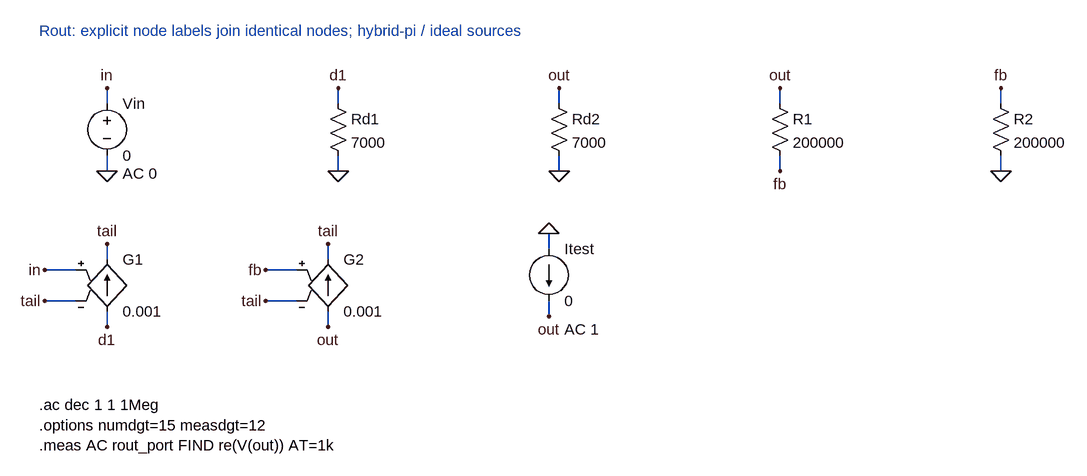
[diagram p0: schematic Rout.asc]
Rout.asc, the LTspice schematic file:
Version 4
SHEET 1 1800 1500
TEXT 16 -48 Left 2 ;Rout: explicit node labels join identical nodes; hybrid-pi / ideal sources
WIRE 120 64 120 40
FLAG 120 40 in
WIRE 120 144 120 168
FLAG 120 168 0
SYMBOL voltage 120 48 R0
SYMATTR InstName Vin
WINDOW 123 24 124 Left 2
SYMATTR Value 0
SYMATTR Value2 AC 0
WIRE 476 64 476 40
FLAG 476 40 d1
WIRE 476 144 476 168
FLAG 476 168 0
SYMBOL res 460 48 R0
SYMATTR InstName Rd1
SYMATTR Value 7000
WIRE 816 64 816 40
FLAG 816 40 out
WIRE 816 144 816 168
FLAG 816 168 0
SYMBOL res 800 48 R0
SYMATTR InstName Rd2
SYMATTR Value 7000
WIRE 1156 64 1156 40
FLAG 1156 40 out
WIRE 1156 144 1156 168
FLAG 1156 168 fb
SYMBOL res 1140 48 R0
SYMATTR InstName R1
SYMATTR Value 200000
WIRE 1496 64 1496 40
FLAG 1496 40 fb
WIRE 1496 144 1496 168
FLAG 1496 168 0
SYMBOL res 1480 48 R0
SYMATTR InstName R2
SYMATTR Value 200000
WIRE 120 384 120 408
FLAG 120 408 d1
WIRE 120 304 120 280
FLAG 120 280 tail
WIRE 72 320 24 320
FLAG 24 320 in
WIRE 72 368 24 368
FLAG 24 368 tail
SYMBOL g 120 288 R0
SYMATTR InstName G1
SYMATTR Value 0.001
WIRE 460 384 460 408
FLAG 460 408 out
WIRE 460 304 460 280
FLAG 460 280 tail
WIRE 412 320 364 320
FLAG 364 320 fb
WIRE 412 368 364 368
FLAG 364 368 tail
SYMBOL g 460 288 R0
SYMATTR InstName G2
SYMATTR Value 0.001
WIRE 800 288 800 264
FLAG 800 264 0
WIRE 800 368 800 392
FLAG 800 392 out
SYMBOL current 800 288 R0
SYMATTR InstName Itest
WINDOW 123 24 124 Left 2
SYMATTR Value 0
SYMATTR Value2 AC 1
TEXT 16 528 Left 2 !.ac dec 1 1 1Meg\n.options numdgt=15 measdgt=12\n.meas AC rout_port FIND re(V(out)) AT=1k

The netlist it stands for:
* Rout.asc
Vin in 0 0 AC 0
Rd1 d1 0 7000
Rd2 out 0 7000
R1 out fb 200000
R2 fb 0 200000
G1 d1 tail in tail 0.001
G2 out tail fb tail 0.001
Itest 0 out 0 AC 1
* Rout: explicit node labels join identical nodes; hybrid-pi / ideal sources
.ac dec 1 1 1Meg
.options numdgt=15 measdgt=12
.meas AC rout_port FIND re(V(out)) AT=1k
.backanno
.end

* Results of the author's LTspice run, read from the files saved beside the schematic
* From the log:
*   rout_port: re(V(out))=(68.0602082093dB,0°) at 1000